# EAGLE design hv3layerMSP (EAGLE 6.6.0)
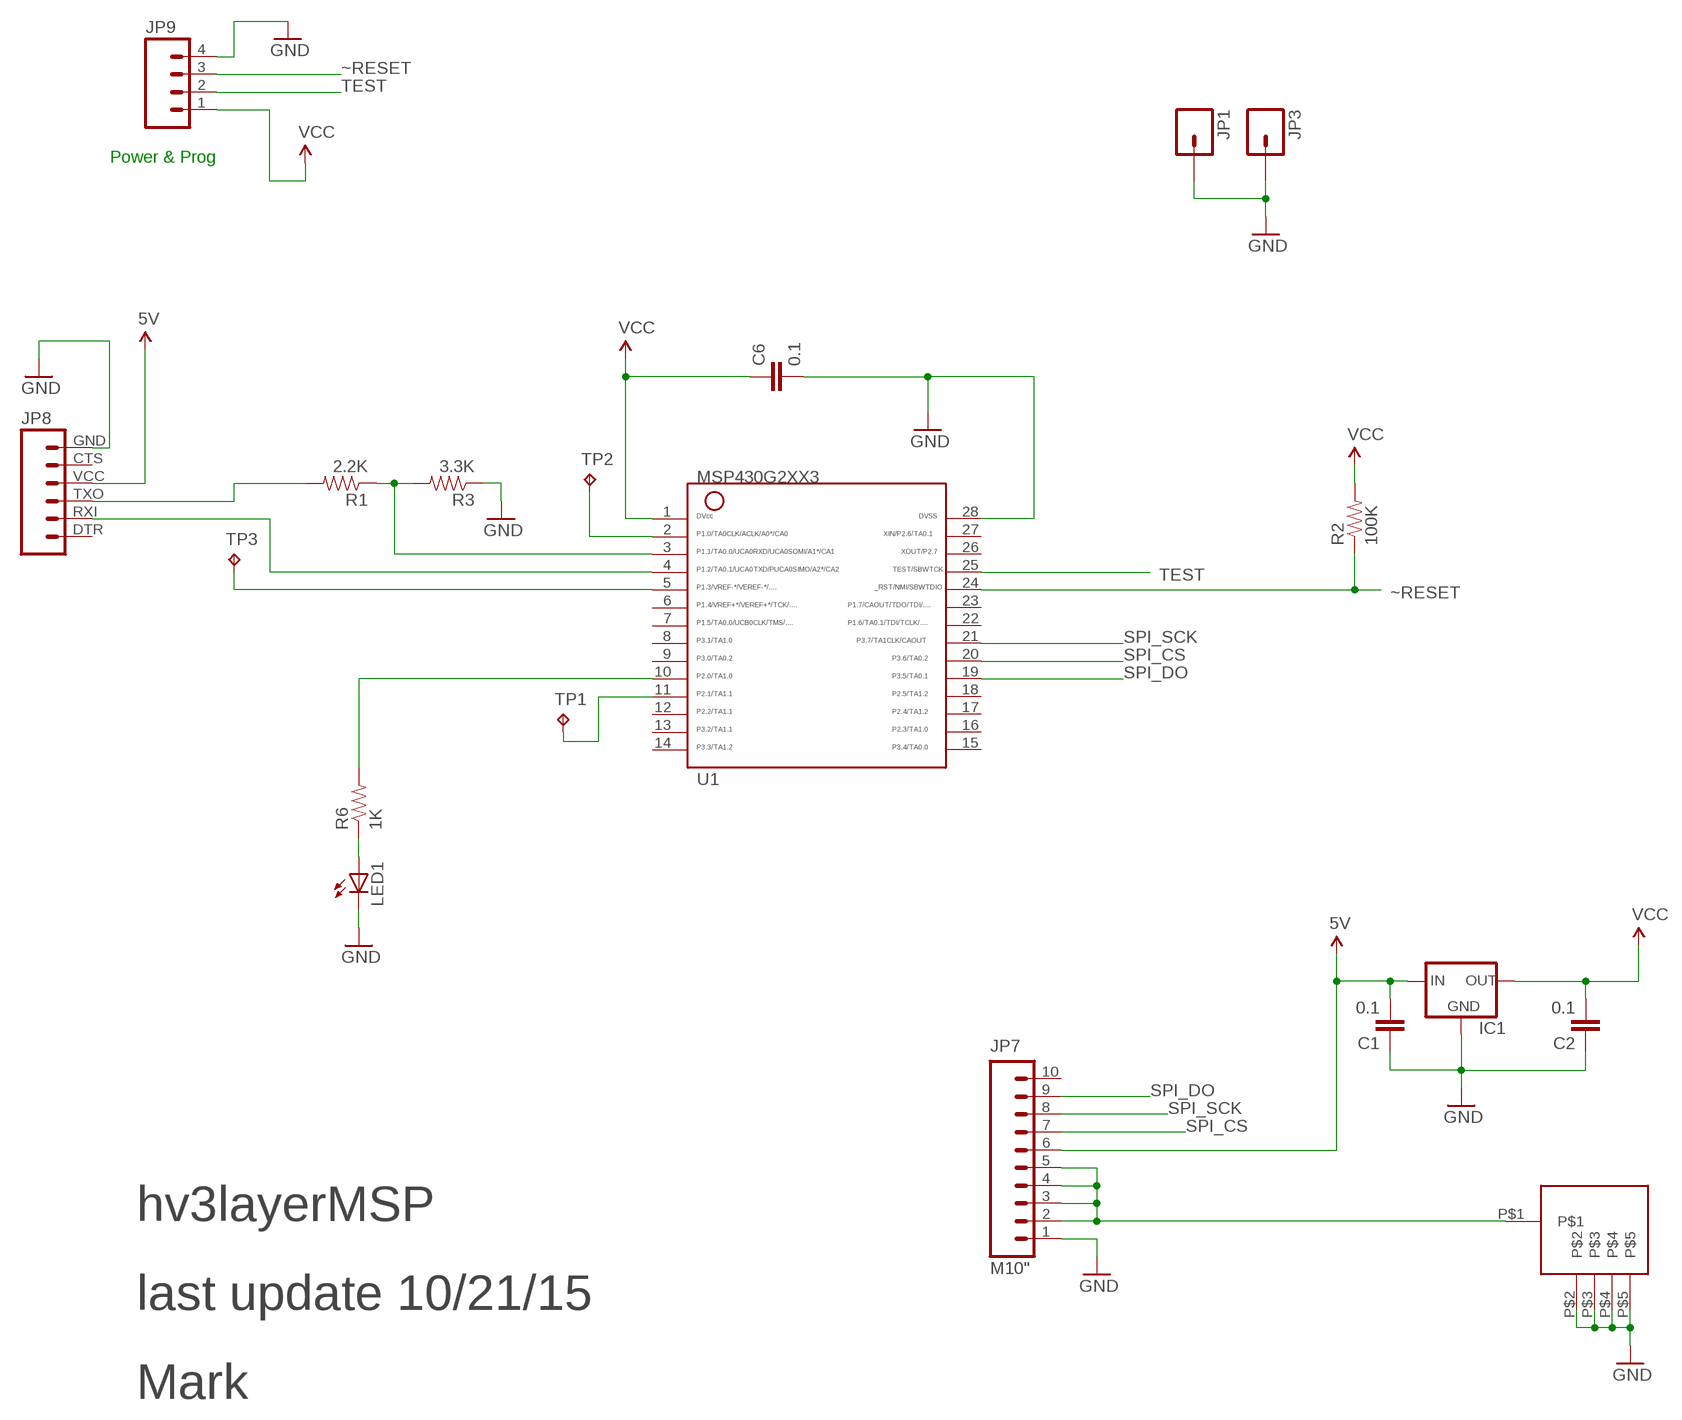
[diagram p0: schematic, sheet 1]

## Parts
C1  0.1  22UF-6.3V-20%(0805)  [0805]
C2  0.1  22UF-6.3V-20%(0805)  [0805]
C6  0.1  22UF-6.3V-20%(0805)  [0805]
IC1  XC63FPM  [SOT23]
JP1  M01PTH  [1X01]
JP3  M01PTH  [1X01]
JP7  M10"  [1X10]
JP8  M06SIP  [1X06]
JP9  M04PTH  [1X04]
LED1  LEDSML0805  [SML0805]
R1  2.2K  RESISTOR0805-RES  [0805]
R2  100K  RESISTOR0805-RES  [0805]
R3  3.3K  RESISTOR0805-RES  [0805]
R6  1K  RESISTOR0805-RES  [0805]
TP1  TPTP10R  [TP10R]
TP2  TPTP10R  [TP10R]
TP3  TPTP10R  [TP10R]
U1  G2XX3---PW28  [PW28]
U$2  SMA  [SMA_EDGE]

## Nets
5V: C1.2 IC1.3(IN) JP7.6 JP8.VCC
GND: C1.1 C2.1 C6.2 IC1.1(GND) JP1.1 JP3.1 JP7.1 JP8.GND JP9.4 LED1.C R3.1 U1.28 U$2.P$2 U$2.P$3 U$2.P$4 U$2.P$5
N$1: TP1.TP U1.11
N$2: TP2.TP U1.2
N$3: TP3.TP U1.5
N$4: R6.2 U1.10
N$5: JP8.TXO R1.2
N$7: R1.1 R3.2 U1.3
N$18: JP8.RXI U1.4
N$22: LED1.A R6.1
N$66: JP7.2 JP7.3 JP7.4 JP7.5 U$2.P$1
SPI_CS: JP7.7 U1.20
SPI_DO: JP7.9 U1.19
SPI_SCK: JP7.8 U1.21
TEST: JP9.2 U1.25
VCC: C2.2 C6.1 IC1.2(OUT) JP9.1 R2.2 U1.1
~RESET: JP9.3 R2.1 U1.24
Unconnected: JP7.10 JP8.CTS JP8.DTR U1.6 U1.7 U1.8 U1.9 U1.12 U1.13 U1.14 U1.15 U1.16 U1.17 U1.18 U1.22 U1.23 U1.26 U1.27

## Notes on the sheet
- Power & Prog
- hv3layerMSP
- last update 10/21/15
- Mark

## Library data of the parts
C1 C2 C6 = SparkFun-Capacitors:22UF-6.3V-20%(0805): CAP-08402 Ceramic; PROD_ID: CAP-08402; VALUE: 22uF
IC1 = v-reg:XC63FP: Positiv Voltage Regulators www.torex.co.jp/english/product/pro02/pdf/0201_xc62fp.pdf
JP1 JP3 = SparkFun-Connectors:M01: Header 1 Standard 1-pin 0.1" header. Use with straight break away headers (SKU : PRT-00116), right angle break away headers (PRT-00553), swiss pins (PRT-00743), machine pins (PRT-00117), and female headers (PRT-00115).
JP7 = SparkFun-Connectors:M10: Header 10 Standard 10-pin 0.1" header. Use with straight break away headers (SKU : PRT-00116), right angle break away headers (PRT-00553), swiss pins (PRT-00743), machine pins (PRT-00117), and female headers (PRT-00115).
JP8 = SparkFun-Connectors:M06: Header 6 Standard 6-pin 0.1" header. Use with straight break away headers (SKU : PRT-00116), right angle break away headers (PRT-00553), swiss pins (PRT-00743), machine pins (PRT-00117), and female headers (PRT-00115). Molex polarized connector foot print use with SKU : PRT-08094 with associated crimp pins and housings. NOTES ON THE VARIANTS LOCK and LOCK_LONGPADS... This footprint was designed to help hold the alignment of a through-hole component (i.e. 6-pin header) while soldering it into place. You may notice that each hole has been shifted either up or down by 0.005 of an inch from it's more standard position (which is a perfectly straight line). This slight alteration caused the pins (the squares in the middle) to touch the edges of the holes. Because they are alternating, it causes a "brace" to hold the component in place. 0.005 has proven to be the perfect amount of "off-center" position when using our standard breakaway headers. Although looks a little odd when you look at the bare footprint, once you have a header in there, the alteration is very hard to notice. Also,if you push a header all the way into place, it is covered up entirely on the bottom side. This idea of altering the position of holes to aid alignment will be further integrated into the Sparkfun Library for other footprints. It can help hold any component with 3 or more connection pins.
JP9 = SparkFun-Connectors:M04: Header 4 Standard 4-pin 0.1" header. Use with straight break away headers (SKU : PRT-00116), right angle break away headers (PRT-00553), swiss pins (PRT-00743), machine pins (PRT-00117), and female headers (PRT-00115). Molex polarized connector foot print use with SKU : PRT-08231 with associated crimp pins and housings. 1MM SMD Version SKU: PRT-10208
LED1 = led:LED: LED OSRAM: - CHIPLED LG R971, LG N971, LY N971, LG Q971, LY Q971, LO R971, LY R971 LH N974, LH R974 LS Q976, LO Q976, LY Q976 LO Q996 - Hyper CHIPLED LW Q18S LB Q993, LB Q99A, LB R99A - SideLED LS A670, LO A670, LY A670, LG A670, LP A670 LB A673, LV A673, LT A673, LW A673 LH A674 LY A675 LS A676, LA A676, LO A676, LY A676, LW A676 LS A679, LY A679, LG A679 - Hyper Micro SIDELED® LS Y876, LA Y876, LO Y876, LY Y876 LT Y87S - SmartLED LW L88C, LW L88S LB L89C, LB L89S, LG L890 LS L89K, LO L89K, LY L89K LS L896, LA L896, LO L896, LY L896 - TOPLED LS T670, LO T670, LY T670, LG T670, LP T670 LSG T670, LSP T670, LSY T670, LOP T670, LYG T670 LG T671, LOG T671, LSG T671 LB T673, LV T673, LT T673, LW T673 LH T674 LS T676, LA T676, LO T676, LY T676, LB T676, LH T676, LSB T676, LW T676 LB T67C, LV T67C, LT T67C, LS T67K, LO T67K, LY T67K, LW E67C LS E67B, LA E67B, LO E67B, LY E67B, LB E67C, LV E67C, LT E67C LW T67C LS T679, LY T679, LG T679 LS T770, LO T770, LY T770, LG T770, LP T770 LB T773, LV T773, LT T773, LW T773 LH T774 LS E675, LA E675, LY E675, LS T675 LS T776, LA T776, LO T776, LY T776, LB T776 LHGB T686 LT T68C, LB T68C - Hyper Mini TOPLED® LB M676 - Mini TOPLED Santana® LG M470 LS M47K, LO M47K, LY M47K Source: http://www.osram.convergy.de LUXEON: - LUMILED® LXK2-PW12-R00, LXK2-PW12-S00, LXK2-PW14-U00, LXK2-PW14-V00 LXK2-PM12-R00, LXK2-PM12-S00, LXK2-PM14-U00 LXK2-PE12-Q00, LXK2-PE12-R00, LXK2-PE12-S00, LXK2-PE14-T00, LXK2-PE14-U00 LXK2-PB12-K00, LXK2-PB12-L00, LXK2-PB12-M00, LXK2-PB14-N00, LXK2-PB14-P00, LXK2-PB14-Q00 LXK2-PR12-L00, LXK2-PR12-M00, LXK2-PR14-Q00, LXK2-PR14-R00 LXK2-PD12-Q00, LXK2-PD12-R00, LXK2-PD12-S00 LXK2-PH12-R00, LXK2-PH12-S00 LXK2-PL12-P00, LXK2-PL12-Q00, LXK2-PL12-R00 Source: www.luxeon.com KINGBRIGHT: KA-3528ASYC Source: www.kingbright.com
R1-R3 R6 = SparkFun-Passives:RESISTOR: Resistor Basic schematic elements and footprints for 0603, 1206, and PTH resistors.
TP1-TP3 = testpad:TP: Test pad
U1 = TI_MSP430_v16:G2XX3---PW28: MSP430G2XX1 TSSOP (PW) 28 Pin Package
U$2 = specials:SMA

## Board
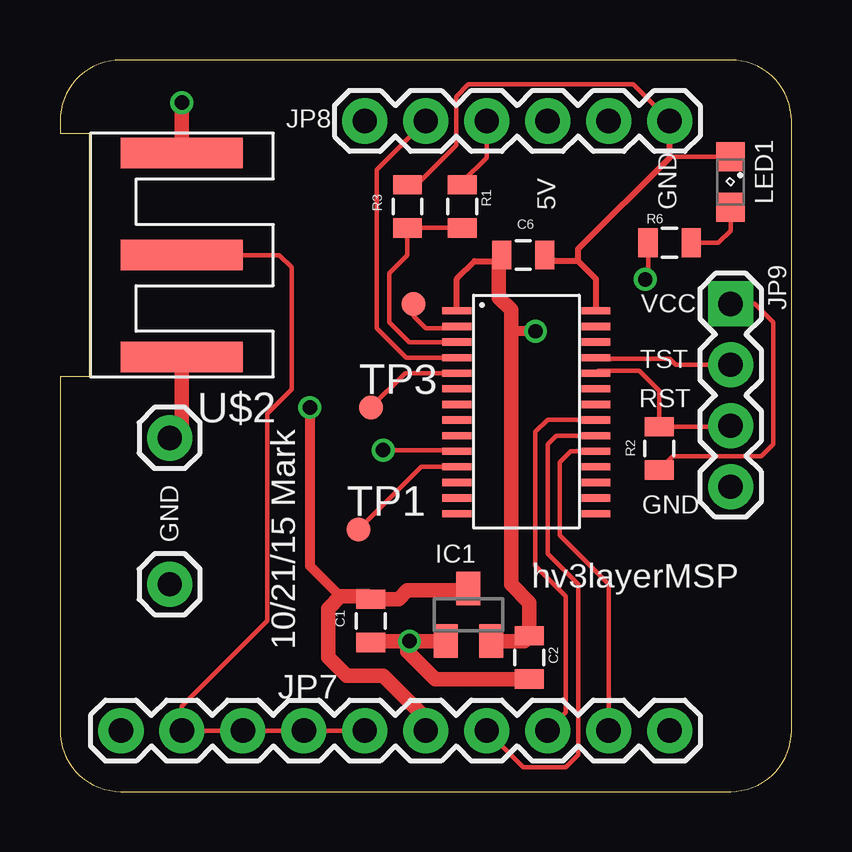
[diagram p1: board, top side]
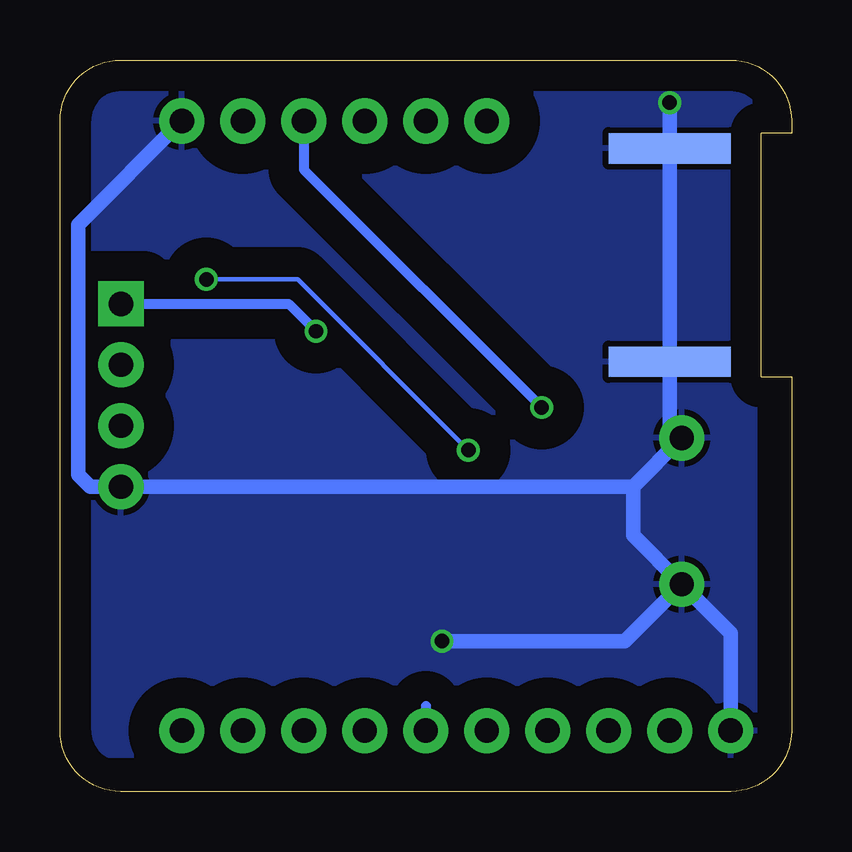
[diagram p2: board, bottom side, seen from below]

Size 30.48 x 30.48 mm. Coordinates in mm from the lower left corner, seen from the top.
Outline: 0,27.43 1.27,27.43 1.27,17.27 0,17.27 0,2.54 arc90 2.54,0 27.94,0 arc90 30.48,2.54 30.48,27.94 arc90 27.94,30.48 2.54,30.48 arc90 0,27.94 0,27.43
Copper layers (1*16): Top 0.0356mm / dielectric 1.5011mm / Bottom 0.0356mm
Design rules "oshpark": minimum track width 6mil, minimum drill 13mil, track to track 6mil, track to pad 6mil, pad to pad 6mil, via to via 6mil, smd to smd 6mil, copper to edge 15mil, drill to drill 6mil, minimum pad ring 7mil, minimum via ring 7mil, stop-mask expansion 3mil, vias tented up to drill 0mil, thermal gap 10mil

### Footprints (pad centres in the part's own frame; a part is rotated, then mirrored left to right if it is on the bottom)
0805 = smd 0.8 x 1.2: 1 -0.9,0; 2 0.9,0
SOT23 = smd 1 x 1.4: 1 -0.95,-1.1; 2 0.95,-1.1; 3 0,1.1
1X01 = drill 1.016 pad 1.88: 1 0,0
1X10 = drill 1.016 pad 1.88: 1 0,0; 2 2.54,0; 3 5.08,0; 4 7.62,0; 5 10.16,0; 6 12.7,0; 7 15.24,0; 8 17.78,0; 9 20.32,0; 10 22.86,0
1X06 = drill 1.016 pad 1.88: CTS 10.16,0; DTR 0,0; GND 12.7,0; RXI 2.54,0; TXO 5.08,0; VCC 7.62,0
1X04 = drill 1.016 pad 1.88 square: 1 0,0 | drill 1.016 pad 1.88: 2 2.54,0; 3 5.08,0; 4 7.62,0
SML0805 = smd 1.2 x 1.2: A 1.05,0; C -1.05,0
TP10R = smd 1 x 1: TP 0,0
PW28 = smd 0.3 x 1.2: 1 -4.229,-2.908; 2 -3.579,-2.908; 3 -2.929,-2.908; 4 -2.279,-2.908; 5 -1.629,-2.908; 6 -0.979,-2.908; 7 -0.329,-2.908; 8 0.321,-2.908; 9 0.971,-2.908; 10 1.621,-2.908; 11 2.271,-2.908; 12 2.921,-2.908; 13 3.571,-2.908; 14 4.221,-2.908; 15 4.221,2.892; 16 3.571,2.892; 17 2.921,2.892; 18 2.271,2.892; 19 1.621,2.892; 20 0.971,2.892; 21 0.321,2.892; 22 -0.329,2.892; 23 -0.979,2.892; 24 -1.629,2.892; 25 -2.279,2.892; 26 -2.929,2.892; 27 -3.579,2.892; 28 -4.229,2.892
SMA_EDGE = smd 5.08 x 1.27: P$1 -1.27,0; P$2 -1.27,4.255; P$3 -1.27,-4.255 | smd 5.08 x 1.27 bottom: P$4 -1.27,4.445; P$5 -1.27,-4.445

### Placement (x,y rotation side)
C1  12.95,7.11 90 top
C2  19.56,5.59 90 top
C6  19.3,22.35 0 top
IC1  17.02,7.37 0 top
JP1  4.57,8.64 0 top
JP3  4.57,14.73 0 top
JP7  2.54,2.54 0 top
JP8  12.7,27.94 0 top
JP9  27.94,20.32 270 top
LED1  27.94,25.4 270 top
R1  16.76,24.38 90 top
R2  24.97,14.3 270 top
R3  14.48,24.38 270 top
R6  25.4,22.86 180 top
TP1  12.45,10.92 0 top
TP2  14.73,20.32 0 top
TP3  12.95,16 0 top
U1  19.44,15.8 270 top
U$2  3.81,22.35 180 top

### Tracks (layer width: path | path; a pad name or v marks a point on that pad's centre or on a via)
5V  (via drill 0.6)
  Top 0.406: v10.41,16 10.41,9.4 11.68,8.13
  Top 0.61: JP7.6 15.24,3.05 13.46,4.83 11.94,4.83 11.18,5.59 11.18,7.62 11.68,8.13 12.84,8.13 C1.2 14.11,8.01 14.48,8.38 16.93,8.38 IC1.3
  Bottom 0.406: JP8.VCC 20.32,25.91 v10.41,16 | 15.24,3.56 JP7.6
GND  (via drill 0.6)
  Top 0.178: C6.2 20.34,22.35 | LED1.C 25.43,26.45 25.4,26.42 | R3.1 14.87,25.28 16.51,26.92 16.51,28.96 17.02,29.46 23.88,29.46 JP8.GND
  Top 0.254: U1.28 22.33,21.35 21.59,22.1 | 21.59,22.1 20.6,22.1 20.34,22.35 | 21.59,22.1 21.59,22.61 25.4,26.42 JP8.GND
  Top 0.61: U$2.P$2 5.08,15.24 JP3.1 | v5.08,28.7 U$2.P$3 | IC1.1 v14.56,6.27 14.48,6.27 | 14.48,6.27 13.01,6.27 C1.1 | C2.1 15.63,4.69 14.48,5.84 14.48,6.27
  Bottom 0.178: U$2.P$5 5.08,26.67 5.08,26.42
  Bottom 0.61: 6.6,12.7 JP9.4 29.21,12.7 29.72,13.21 29.72,23.62 JP8.GND | 6.6,12.7 JP3.1 5.08,15.24 U$2.P$4 5.08,26.67 v5.08,28.7 | 6.6,12.7 6.6,10.67 JP1.1 | JP1.1 2.54,6.6 JP7.1 | v14.56,6.27 6.94,6.27 JP1.1
  pour Bottom (isolate 1.27): 2.54,29.72 29.21,29.72 29.21,1.52 1.52,1.52 1.52,2.29 1.52,29.72 2.29,29.72
N$1
  Top 0.178: U1.11 15.05,13.53 TP1.TP
N$2
  Top 0.178: TP2.TP 14.73,19.81 15.24,19.3 16.46,19.3 U1.2
N$3
  Top 0.178: TP3.TP 14.38,17.43 U1.5
N$4  (via drill 0.6)
  Top 0.178: R6.2 24.5,21.45 v24.38,21.34 | v13.46,14.22 16.49,14.22 U1.10
  Bottom 0.178: v24.38,21.34 20.57,21.34 v13.46,14.22
N$5
  Top 0.178: R1.2 16.76,25.4 17.78,26.42 JP8.TXO
N$7
  Top 0.178: U1.3 14.54,18.73 13.72,19.56 13.72,21.59 14.48,22.35 R3.2 R1.1
N$18
  Top 0.178: U1.4 14.43,18.08 13.21,19.3 13.21,25.91 JP8.RXI
N$22
  Top 0.178: R6.1 27.43,22.86 27.94,23.37 LED1.A
N$66
  Top 0.178: U$2.P$1 9.14,22.35 9.65,21.84 9.65,16.76 8.64,15.75 8.64,7.11 5.08,3.56 JP7.2 JP7.3 JP7.4 JP7.5
SPI_CS
  Top 0.178: U1.20 20.67,14.83 20.32,14.48 20.32,9.91 21.59,8.64 21.59,1.52 21.08,1.02 19.3,1.02 JP7.7
SPI_DO
  Top 0.178: U1.19 21.29,14.18 20.83,13.72 20.83,10.67 22.86,8.64 JP7.9
SPI_SCK
  Top 0.178: U1.21 22.32,15.49 20.32,15.49 19.81,14.99 19.81,9.4 21.08,8.13 21.08,3.3 JP7.8
TEST
  Top 0.178: JP9.2 25.65,17.78 25.4,18.03 22.38,18.03 U1.25
VCC  (via drill 0.6)
  Top 0.178: JP9.1 28.96,20.32 29.72,19.56 29.72,14.48 29.21,13.97 25.54,13.97 R2.2
  Top 0.254: U1.1 16.53,21.36 17.27,22.1 18.34,22.1 C6.1
  Top 0.406: v19.81,19.18 18.8,19.18
  Top 0.61: IC1.2 19.34,6.27 C2.2 19.56,7.87 18.8,8.64 18.8,19.18 18.8,20.07 18.29,20.57 18.29,22.05 18.34,22.1
  Bottom 0.406: JP9.1 20.95,20.32 v19.81,19.18
~RESET
  Top 0.178: U1.24 22.43,17.53 24.13,17.53 24.97,16.69 R2.1 27.9,15.2 JP9.3

### Text on the board
tPlace: 5V | GND | VCC | TST | RST | GND | GND | hv3layerMSP | 10/21/15 Mark